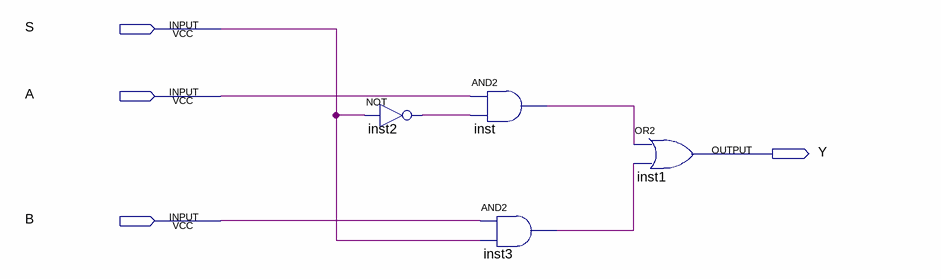
[diagram p0: schematic sheet]
// Quartus schematic MUX2TO1.bdf as structural Verilog: 4 symbols, 4 pins
module MUX2TO1 (
  input  S,
  input  A,
  input  B,
  output Y
);

  wire inst2_out, inst3_out, inst_out;

  not inst2 (inst2_out, S);
  and inst (inst_out, A, inst2_out);
  and inst3 (inst3_out, B, S);
  or inst1 (Y, inst_out, inst3_out);
endmodule
